# Altium project walkEEG_ADC.PrjPCB
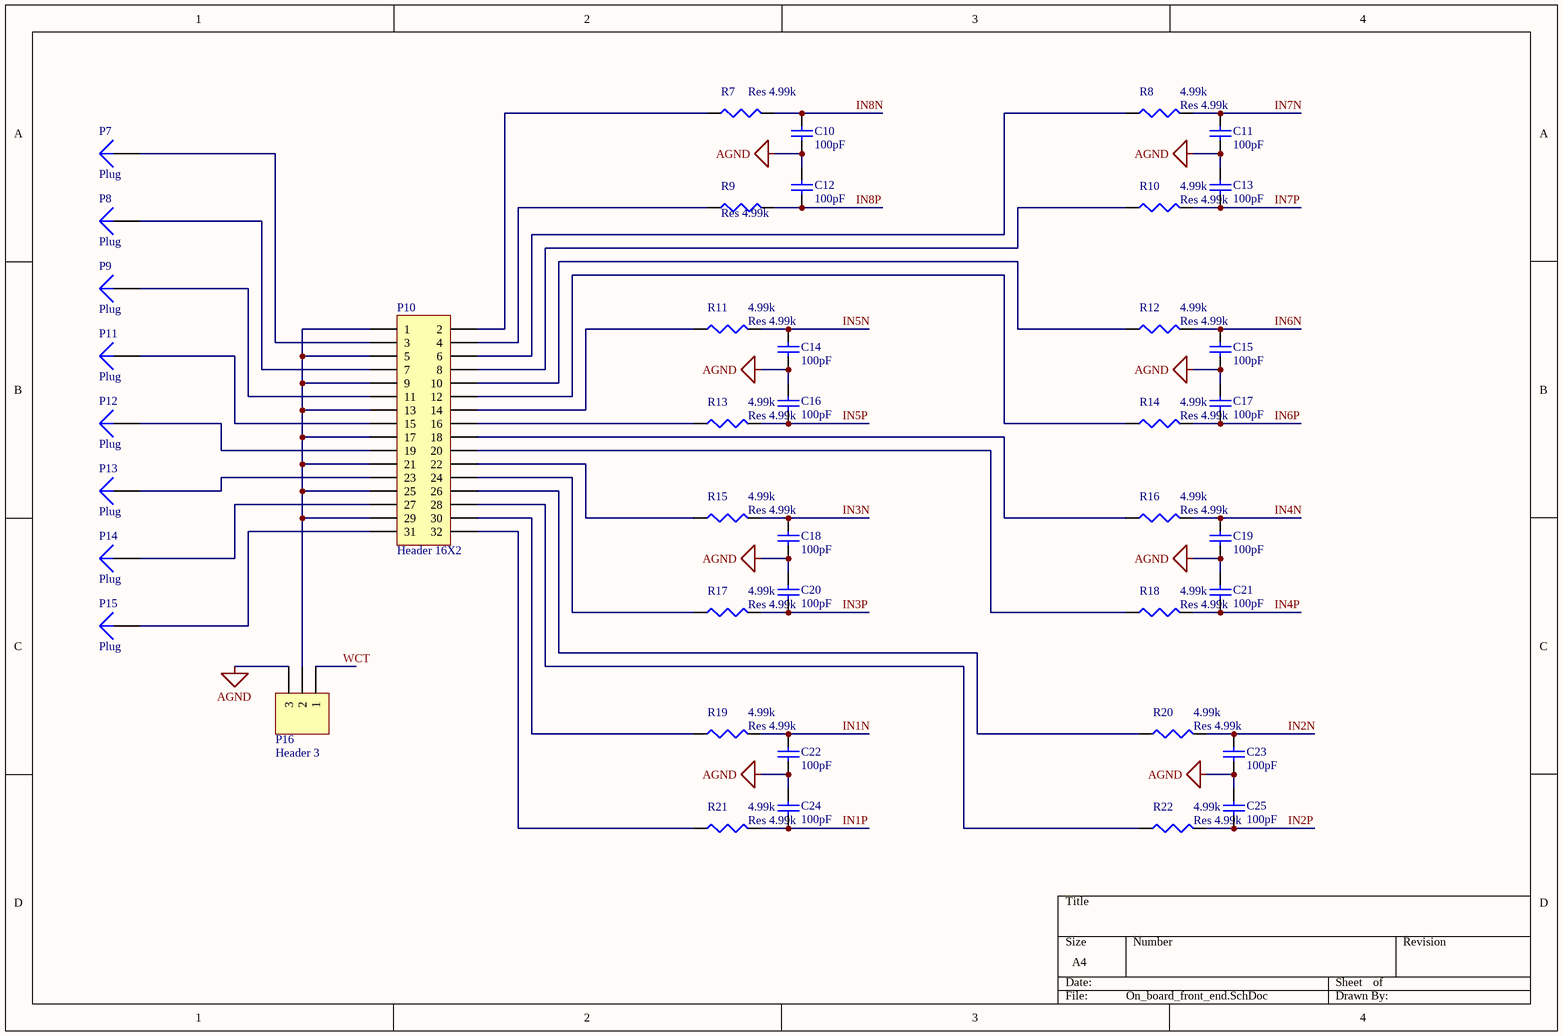
[diagram p0: On_board_front_end.SchDoc]
4 sheets, 79 parts. Net scope: global (net labels, ports and power ports of the same name join across sheets).
Board file: ADC_broad.PcbDoc
Sheets:
  On_board_front_end.SchDoc
  ADC.SchDoc
  PW.SchDoc
  isolation.SchDoc

## Sheet On_board_front_end.SchDoc
size A4

### Parts
C10  value 100pF  [1608[0603]]  (hidden comment: Cap 100pF)
C11  value 100pF  [1608[0603]]  (hidden comment: Cap 100pF)
C12  value 100pF  [1608[0603]]  (hidden comment: Cap 100pF)
C13  value 100pF  [1608[0603]]  (hidden comment: Cap 100pF)
C14  value 100pF  [1608[0603]]  (hidden comment: Cap 100pF)
C15  value 100pF  [1608[0603]]  (hidden comment: Cap 100pF)
C16  value 100pF  [1608[0603]]  (hidden comment: Cap 100pF)
C17  value 100pF  [1608[0603]]  (hidden comment: Cap 100pF)
C18  value 100pF  [1608[0603]]  (hidden comment: Cap 100pF)
C19  value 100pF  [1608[0603]]  (hidden comment: Cap 100pF)
C20  value 100pF  [1608[0603]]  (hidden comment: Cap 100pF)
C21  value 100pF  [1608[0603]]  (hidden comment: Cap 100pF)
C22  value 100pF  [1608[0603]]  (hidden comment: Cap 100pF)
C23  value 100pF  [1608[0603]]  (hidden comment: Cap 100pF)
C24  value 100pF  [1608[0603]]  (hidden comment: Cap 100pF)
C25  value 100pF  [1608[0603]]  (hidden comment: Cap 100pF)
P7  Plug  [PIN1]
P8  Plug  [PIN1]
P9  Plug  [PIN1]
P10  Header 16X2  [HDR2X16]
P11  Plug  [PIN1]
P12  Plug  [PIN1]
P13  Plug  [PIN1]
P14  Plug  [PIN1]
P15  Plug  [PIN1]
P16  Header 3  [HDR1X3]
R7  Res 4.99k  [0402]
R8  Res 4.99k  value 4.99k  [0402]
R9  Res 4.99k  [0402]
R10  Res 4.99k  value 4.99k  [0402]
R11  Res 4.99k  value 4.99k  [0402]
R12  Res 4.99k  value 4.99k  [0402]
R13  Res 4.99k  value 4.99k  [0402]
R14  Res 4.99k  value 4.99k  [0402]
R15  Res 4.99k  value 4.99k  [0402]
R16  Res 4.99k  value 4.99k  [0402]
R17  Res 4.99k  value 4.99k  [0402]
R18  Res 4.99k  value 4.99k  [0402]
R19  Res 4.99k  value 4.99k  [0402]
R20  Res 4.99k  value 4.99k  [0402]
R21  Res 4.99k  value 4.99k  [0402]
R22  Res 4.99k  value 4.99k  [0402]

### Nets
AGND: C10.2 C11.2 C12.1 C13.1 C14.2 C15.2 C16.1 C17.1 C18.2 C19.2 C20.1 C21.1 C22.2 C23.2 C24.1 C25.1 P16.3
IN1N: C22.1 R19.2
IN1P: C24.2 R21.2
IN2N: C23.1 R20.2
IN2P: C25.2 R22.2
IN3N: C18.1 R15.2
IN3P: C20.2 R17.2
IN4N: C19.1 R16.2
IN4P: C21.2 R18.2
IN5N: C14.1 R11.2
IN5P: C16.2 R13.2
IN6N: C15.1 R12.2
IN6P: C17.2 R14.2
IN7N: C11.1 R8.2
IN7P: C13.2 R10.2
IN8N: C10.1 R7.2
IN8P: C12.2 R9.2
WCT: P16.1
NetP7_1: P7.1 P10.3
NetP8_1: P8.1 P10.7
NetP9_1: P9.1 P10.11
NetP10_1: P10.1 P10.5 P10.9 P10.13 P10.17 P10.21 P10.25 P10.29 P16.2
NetP10_2: P10.2 R7.1
NetP10_4: P10.4 R9.1
NetP10_6: P10.6 R8.1
NetP10_8: P10.8 R10.1
NetP10_10: P10.10 R12.1
NetP10_12: P10.12 R14.1
NetP10_14: P10.14 R11.1
NetP10_15: P10.15 P11.1
NetP10_16: P10.16 R13.1
NetP10_18: P10.18 R16.1
NetP10_19: P10.19 P12.1
NetP10_20: P10.20 R18.1
NetP10_22: P10.22 R15.1
NetP10_23: P10.23 P13.1
NetP10_24: P10.24 R17.1
NetP10_26: P10.26 R20.1
NetP10_27: P10.27 P14.1
NetP10_28: P10.28 R22.1
NetP10_30: P10.30 R19.1
NetP10_31: P10.31 P15.1
NetP10_32: P10.32 R21.1

### Library data of the parts
C10-C25 = Cap: Capacitor; Published: 8-Jun-2000; LatestRevisionDate: 17-Jul-2002; LatestRevisionNote: Re-released for DXP Platform.; PackageReference: RAD-0.3; Publisher: Altium Limited; PackageDescription: Radial Cap, Thru-Hole; 2 Leads; 0.3 in Pin Spacing
P10 = Header 16X2: Header, 16-Pin, Dual row; LatestRevisionDate: 17-Jul-2002; LatestRevisionNote: Re-released for DXP Platform.; Publisher: Altium Limited
P16 = Header 3: Header, 3-Pin; LatestRevisionDate: 17-Jul-2002; LatestRevisionNote: Re-released for DXP Platform.; Publisher: Altium Limited
R7-R22 = Res3: Resistor; Published: 8-Jun-2000; LatestRevisionDate: 29-May-2009; LatestRevisionNote: IPC-7351 Footprint Added.; PackageReference: J1-0603; Publisher: Altium Limited; PackageDescription: Chip Resistor
P7-P9 P11-P15 = Plug: LatestRevisionDate: 17-Jul-2002; LatestRevisionNote: Re-released for DXP Platform.; Publisher: Altium Limited

## Sheet ADC.SchDoc
size A4
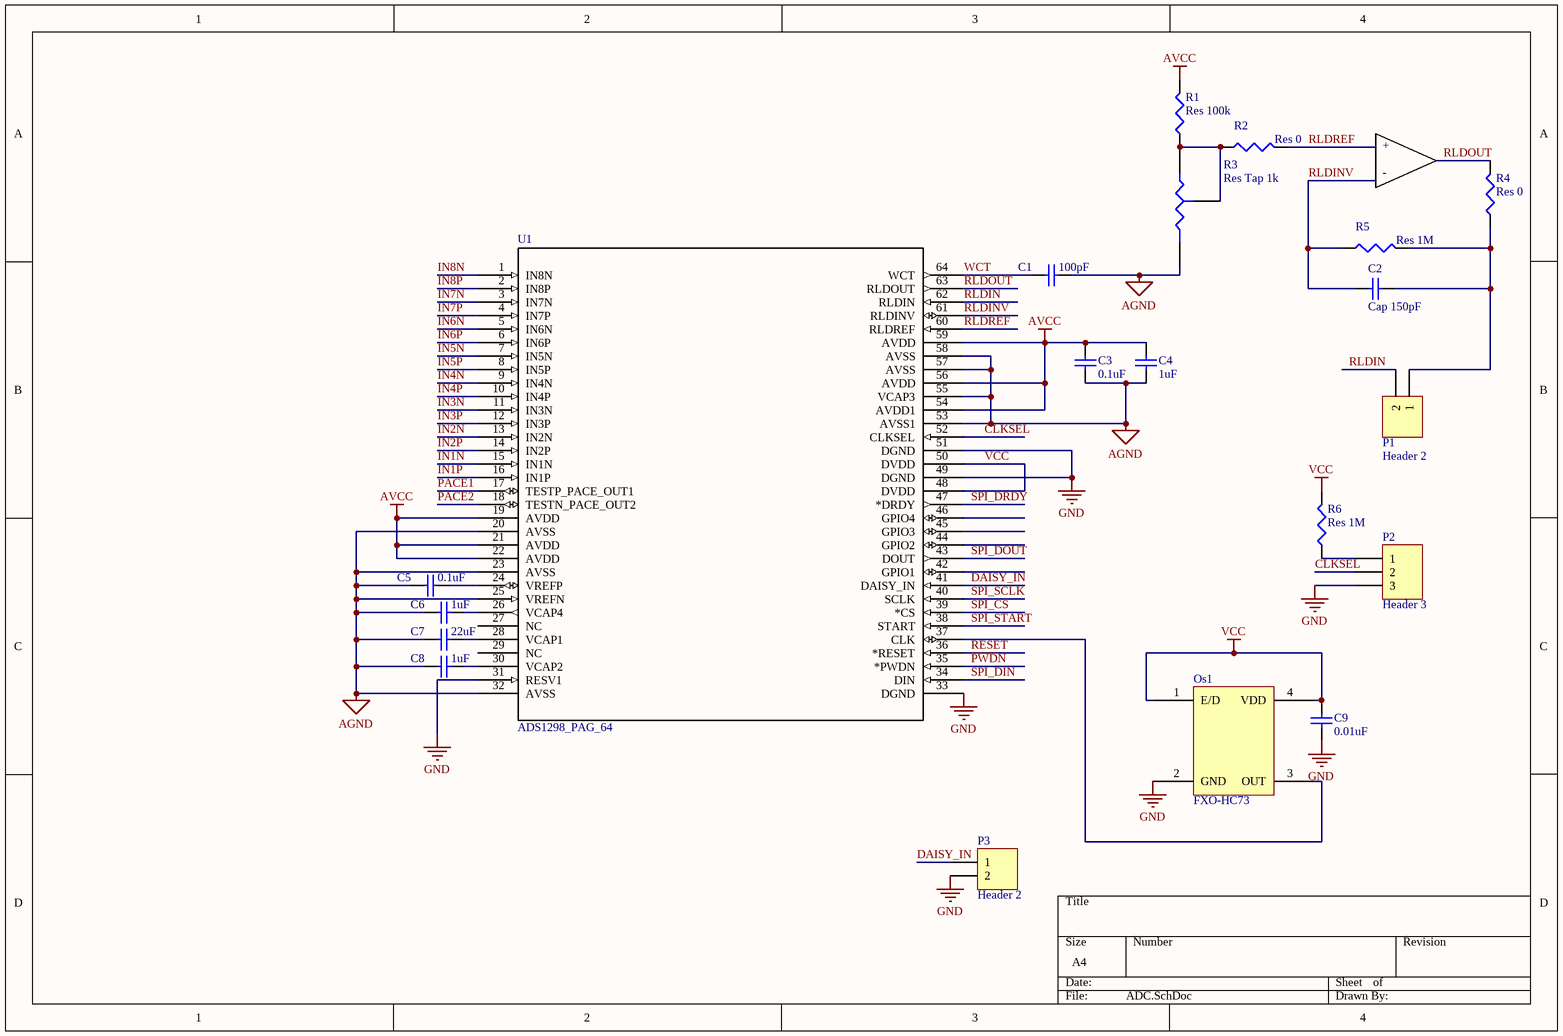
[diagram p1: ADC.SchDoc]

### Parts
C1  value 100pF  [0402]  (hidden comment: Cap 100pF)
C2  Cap 150pF  [0402]
C3  value 0.1uF  [0402]  (hidden comment: Cap 100nF)
C4  value 1uF  [0402]  (hidden comment: Cap 1uF)
C5  value 0.1uF  [0402]  (hidden comment: Cap 100nF)
C6  value 1uF  [0402]  (hidden comment: Cap 1uF)
C7  value 22uF  [0402]  (hidden comment: Cap 22uF)
C8  value 1uF  [0402]  (hidden comment: Cap 1uF)
C9  value 0.01uF  [0402]  (hidden comment: Cap 10nF)
Os1  FXO-HC73  [PCBComponent_1]
P1  Header 2  [HDR1X2]
P2  Header 3  [HDR1X3]
P3  Header 2  [HDR1X2]
R1  Res 100k  [0402]
R2  Res 0  [0402]
R3  Res Tap 1k  [VR4]
R4  Res 0  [0402]
R5  Res 1M  [0402]
R6  Res 1M  [0402]
U1  ADS1298_PAG_64  [PAG64]

### Nets
AGND: C1.1 C3.2 C4.2 C5.2 C6.2 C7.2 C8.2 C9.2 Os1.2(GND) P2.3 P3.2 R3.2(B) U1.20(AVSS) U1.23(AVSS) U1.25(VREFN) U1.31(RESV1) U1.32(AVSS) U1.33(DGND) U1.49(DGND) U1.51(DGND) U1.53(AVSS1) U1.55(VCAP3) U1.57(AVSS) U1.58(AVSS)  [also labelled GND]
AVCC: C3.1 C4.1 R1.2 U1.19(AVDD) U1.21(AVDD) U1.22(AVDD) U1.54(AVDD1) U1.56(AVDD) U1.59(AVDD)
VCC: C9.1 Os1.1(E/D) Os1.4(VDD) R6.2 U1.48(DVDD) U1.50(DVDD)
CLKSEL: P2.2 U1.52(CLKSEL)
DAISY_IN: P3.1 U1.41(DAISY_IN)
IN1N: U1.15(IN1N)
IN1P: U1.16(IN1P)
IN2N: U1.13(IN2N)
IN2P: U1.14(IN2P)
IN3N: U1.11(IN3N)
IN3P: U1.12(IN3P)
IN4N: U1.9(IN4N)
IN4P: U1.10(IN4P)
IN5N: U1.7(IN5N)
IN5P: U1.8(IN5P)
IN6N: U1.5(IN6N)
IN6P: U1.6(IN6P)
IN7N: U1.3(IN7N)
IN7P: U1.4(IN7P)
IN8N: U1.1(IN8N)
IN8P: U1.2(IN8P)
~{PWD}N: U1.35(*PWDN)
PACE1: U1.17(TESTP_PACE_OUT1)
PACE2: U1.18(TESTN_PACE_OUT2)
~{RESET}: U1.36(*RESET)
RLDIN: P1.2 U1.62(RLDIN)
RLDINV: C2.2 R5.1 U1.61(RLDINV)
RLDOUT: R4.2 U1.63(RLDOUT)
RLDREF: R2.2 U1.60(RLDREF)
SPI_CS: U1.39(*CS)
SPI_DIN: U1.34(DIN)
SPI_DOUT: U1.43(DOUT)
SPI_DRDY: U1.47(*DRDY)
SPI_SCLK: U1.40(SCLK)
SPI_START: U1.38(START)
WCT: C1.2 U1.64(WCT)
NetC2_1: C2.1 P1.1 R4.1 R5.2
NetC5_1: C5.1 U1.24(VREFP)
NetC6_1: C6.1 U1.26(VCAP4)
NetC7_1: C7.1 U1.28(VCAP1)
NetC8_1: C8.1 U1.30(VCAP2)
NetOs1_3: Os1.3(OUT) U1.37(CLK)
NetP2_1: P2.1 R6.1
NetR1_1: R1.1 R2.1 R3.1(A) R3.3(TAP)

Not connected (* = marked no-connect by the designer): U1 27(NC) 29(NC) 42(GPIO1) 44(GPIO2) 45(GPIO3) 46(GPIO4)

### Notes on the sheet
- +
- -

### Library data of the parts
C1 C3-C9 = Cap: Capacitor; Published: 8-Jun-2000; LatestRevisionDate: 17-Jul-2002; LatestRevisionNote: Re-released for DXP Platform.; PackageReference: RAD-0.3; Publisher: Altium Limited; PackageDescription: Radial Cap, Thru-Hole; 2 Leads; 0.3 in Pin Spacing
C2 = Cap Semi: Capacitor (Semiconductor SIM Model); Published: 8-Jun-2000; LatestRevisionDate: 29-May-2009; LatestRevisionNote: IPC-7351 Footprint Added.; PackageReference: C1206; Publisher: Altium Limited; PackageDescription: Chip Capacitor
P1 P3 = Header 2: Header, 2-Pin; LatestRevisionDate: 17-Jul-2002; LatestRevisionNote: Re-released for DXP Platform.; Publisher: Altium Limited
P2 = Header 3: Header, 3-Pin; LatestRevisionDate: 17-Jul-2002; LatestRevisionNote: Re-released for DXP Platform.; Publisher: Altium Limited
R1 R2 R4-R6 = Res3: Resistor; Published: 8-Jun-2000; LatestRevisionDate: 29-May-2009; LatestRevisionNote: IPC-7351 Footprint Added.; PackageReference: J1-0603; Publisher: Altium Limited; PackageDescription: Chip Resistor
R3 = Res Tap: Tapped Resistor; Sim Note: Enter the Resistance value and the set point into parameter fields.; Set Position: 0.5; Published: 24-Mar-1999; LatestRevisionDate: 17-Jul-2002; LatestRevisionNote: Re-released for DXP Platform.; PackageReference: VR3; Publisher: Altium Limited; PackageDescription: Variable Resistor, Thru-Hole; 3 Leads
U1 = ADS1298_PAG_64: Imported; Manufacturer: Texas Instruments; INDUSTRY_STD_PKG_TYPE: TQFP; FAMILY_NAME: ECG / EEG Analog Front End; PIN_COUNT: 64; PACKAGE_DESIGNATOR: PAG; Datasheet URL: http://www.ti.com/lit/gpn/ADS1298; GENERIC_PART_NUMBER: ADS1298; RefDes: RefDes; Type: DEV; Value: Value

## Sheet PW.SchDoc
size A4
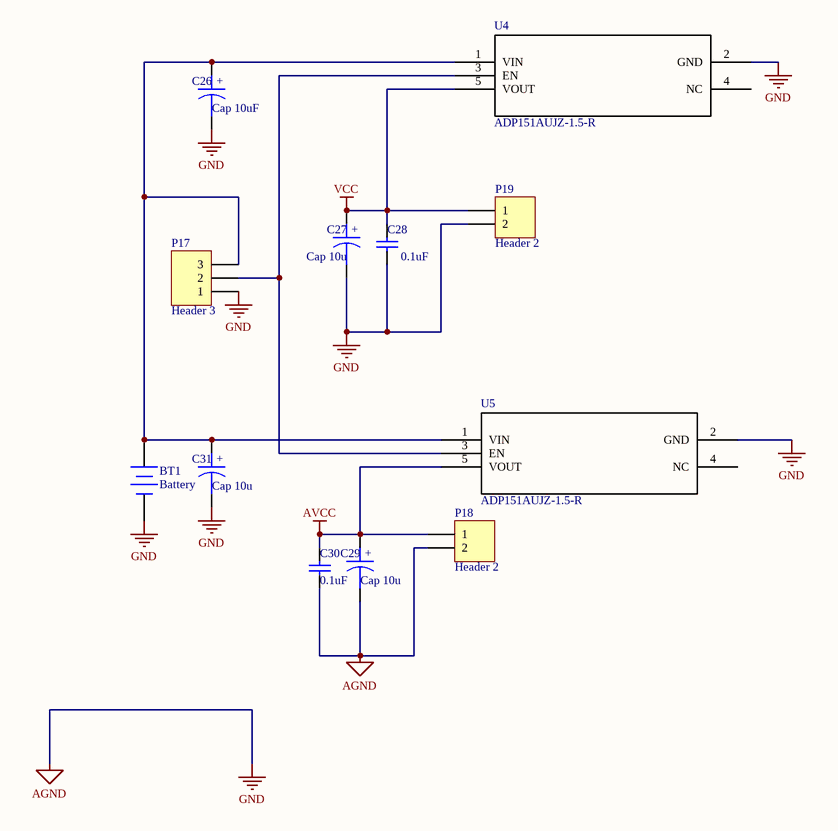
[diagram p2: PW.SchDoc]

### Parts
BT1  Battery  [BAT-2]
C26  Cap 10uF  [C1206]
C27  Cap 10u  [C1206]
C28  value 0.1uF  [0603]  (hidden comment: Cap 100nF)
C29  Cap 10u  [C1206]
C30  value 0.1uF  [0603]  (hidden comment: Cap 100nF)
C31  Cap 10u  [C1206]
P17  Header 3  [HDR1X3]
P18  Header 2  [HDR1X2]
P19  Header 2  [HDR1X2]
U4  ADP151AUJZ-1.5-R  [UJ_5]
U5  ADP151AUJZ-1.5-R  [UJ_5]

### Nets
AGND: BT1.2(-) C26.2 C27.2 C28.1 C29.2 C30.1 C31.2 P17.1 P18.2 P19.2 U4.2(GND) U5.2(GND)  [also labelled GND]
AVCC: C29.1 C30.2 P18.1 U5.5(VOUT)
VCC: C27.1 C28.2 P19.1 U4.5(VOUT)
NetBT1_1: BT1.1(+) C26.1 C31.1 P17.3 U4.1(VIN) U5.1(VIN)
NetP17_2: P17.2 U4.3(EN) U5.3(EN)

Not connected (* = marked no-connect by the designer): U4 4(NC); U5 4(NC)

### Notes on the sheet
- (in symbol CAPACITOR POL) +

### Library data of the parts
BT1 = Battery: Multicell Battery; Published: 24-Mar-1999; LatestRevisionDate: 17-Jul-2002; LatestRevisionNote: Re-released for DXP Platform.; PackageReference: BAT-2; Publisher: Altium Limited; PackageDescription: Battery; 2 Leads
C26 C27 C29 C31 = CAPACITOR POL: Capacitor
C28 C30 = Cap: Capacitor; Published: 8-Jun-2000; LatestRevisionDate: 17-Jul-2002; LatestRevisionNote: Re-released for DXP Platform.; PackageReference: RAD-0.3; Publisher: Altium Limited; PackageDescription: Radial Cap, Thru-Hole; 2 Leads; 0.3 in Pin Spacing
P17 = Header 3: Header, 3-Pin; LatestRevisionDate: 17-Jul-2002; LatestRevisionNote: Re-released for DXP Platform.; Publisher: Altium Limited
P18 P19 = Header 2: Header, 2-Pin; LatestRevisionDate: 17-Jul-2002; LatestRevisionNote: Re-released for DXP Platform.; Publisher: Altium Limited
U4 U5 = ADP151AUJZ-1.5-R: Imported; RefDes: RefDes; Type: DEV; Value: Value

## Sheet isolation.SchDoc
size A4
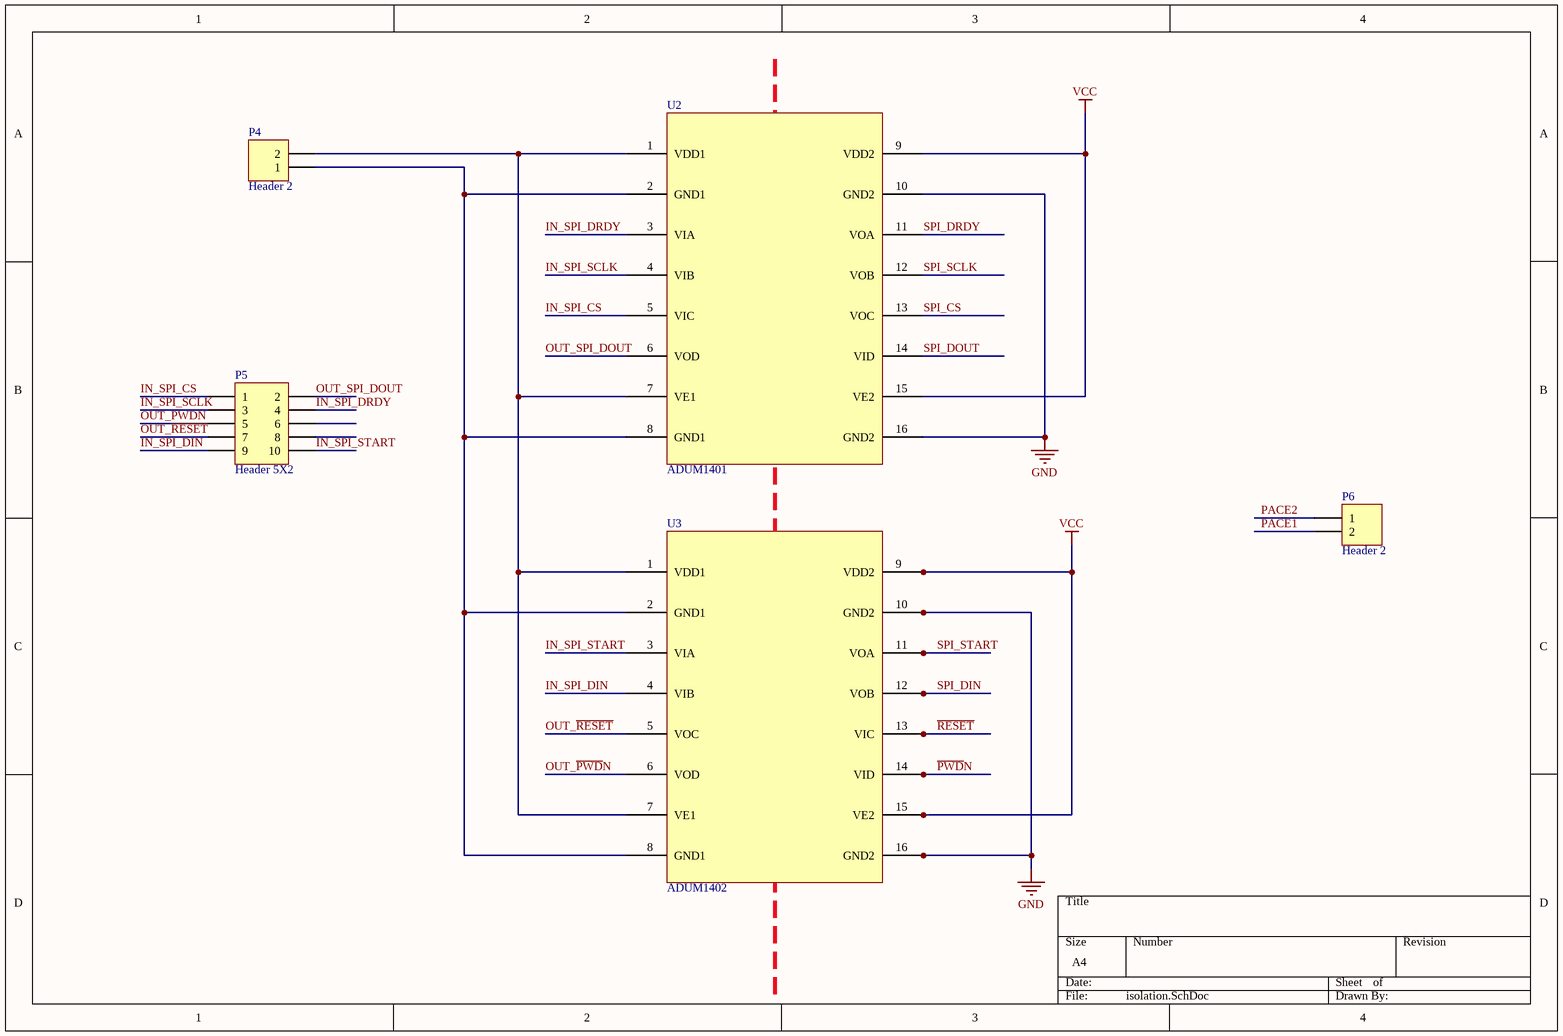
[diagram p3: isolation.SchDoc]

### Parts
P4  Header 2  [HDR1X2]
P5  Header 5X2  [HDR2X5]
P6  Header 2  [HDR1X2]
U2  ADUM1401  [SOIC_W]
U3  ADUM1402  [SOIC_W]

### Nets
GND: U2.10(GND2) U2.16(GND2) U3.10(GND2) U3.16(GND2)  [project net AGND]
VCC: U2.9(VDD2) U2.15(VE2) U3.9(VDD2) U3.15(VE2)
IN_SPI_CS: P5.1 U2.5(VIC)
IN_SPI_DIN: P5.9 U3.4(VIB)
IN_SPI_DRDY: P5.4 U2.3(VIA)
IN_SPI_SCLK: P5.3 U2.4(VIB)
IN_SPI_START: P5.10 U3.3(VIA)
OUT_~{PWD}N: P5.5 U3.6(VOD)
OUT_~{RESET}: P5.7 U3.5(VOC)
OUT_SPI_DOUT: P5.2 U2.6(VOD)
~{PWD}N: U3.14(VID)
PACE1: P6.2
PACE2: P6.1
~{RESET}: U3.13(VIC)
SPI_CS: U2.13(VOC)
SPI_DIN: U3.12(VOB)
SPI_DOUT: U2.14(VID)
SPI_DRDY: U2.11(VOA)
SPI_SCLK: U2.12(VOB)
SPI_START: U3.11(VOA)
NetP4_1: P4.1 U2.2(GND1) U2.8(GND1) U3.2(GND1) U3.8(GND1)
NetP4_2: P4.2 U2.1(VDD1) U2.7(VE1) U3.1(VDD1) U3.7(VE1)

Not connected (* = marked no-connect by the designer): P5 6 8

### Library data of the parts
P4 P6 = Header 2: Header, 2-Pin; LatestRevisionDate: 17-Jul-2002; LatestRevisionNote: Re-released for DXP Platform.; Publisher: Altium Limited
P5 = Header 5X2: Header, 5-Pin, Dual row; LatestRevisionDate: 17-Jul-2002; LatestRevisionNote: Re-released for DXP Platform.; Publisher: Altium Limited
U2 = ADUM1401: ADI isolation

## Nets that join several sheets
AGND: On_board_front_end (17 pins), ADC (24 pins), PW (12 pins), isolation (U2.10 U2.16 U3.10 U3.16)
AVCC: ADC (9 pins), PW (C29.1 C30.2 P18.1 U5.5)
VCC: ADC (6 pins), PW (C27.1 C28.2 P19.1 U4.5), isolation (U2.9 U2.15 U3.9 U3.15)
IN1N: On_board_front_end (C22.1 R19.2), ADC (U1.15)
IN1P: On_board_front_end (C24.2 R21.2), ADC (U1.16)
IN2N: On_board_front_end (C23.1 R20.2), ADC (U1.13)
IN2P: On_board_front_end (C25.2 R22.2), ADC (U1.14)
IN3N: On_board_front_end (C18.1 R15.2), ADC (U1.11)
IN3P: On_board_front_end (C20.2 R17.2), ADC (U1.12)
IN4N: On_board_front_end (C19.1 R16.2), ADC (U1.9)
IN4P: On_board_front_end (C21.2 R18.2), ADC (U1.10)
IN5N: On_board_front_end (C14.1 R11.2), ADC (U1.7)
IN5P: On_board_front_end (C16.2 R13.2), ADC (U1.8)
IN6N: On_board_front_end (C15.1 R12.2), ADC (U1.5)
IN6P: On_board_front_end (C17.2 R14.2), ADC (U1.6)
IN7N: On_board_front_end (C11.1 R8.2), ADC (U1.3)
IN7P: On_board_front_end (C13.2 R10.2), ADC (U1.4)
IN8N: On_board_front_end (C10.1 R7.2), ADC (U1.1)
IN8P: On_board_front_end (C12.2 R9.2), ADC (U1.2)
~{PWD}N: ADC (U1.35), isolation (U3.14)
PACE1: ADC (U1.17), isolation (P6.2)
PACE2: ADC (U1.18), isolation (P6.1)
~{RESET}: ADC (U1.36), isolation (U3.13)
SPI_CS: ADC (U1.39), isolation (U2.13)
SPI_DIN: ADC (U1.34), isolation (U3.12)
SPI_DOUT: ADC (U1.43), isolation (U2.14)
SPI_DRDY: ADC (U1.47), isolation (U2.11)
SPI_SCLK: ADC (U1.40), isolation (U2.12)
SPI_START: ADC (U1.38), isolation (U3.11)
WCT: On_board_front_end (P16.1), ADC (C1.2 U1.64)